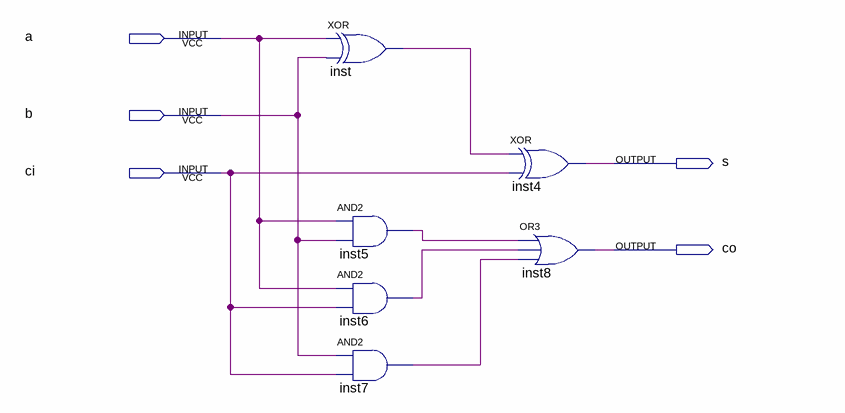
[diagram p0: schematic sheet]
// Quartus schematic plus_minus_1.bdf as structural Verilog: 6 symbols, 5 pins
module plus_minus_1 (
  input  a,
  input  b,
  input  ci,
  output s,
  output co
);

  wire inst5_out, inst6_out, inst7_out, inst_out;

  xor inst (inst_out, a, b);
  and inst5 (inst5_out, a, b);
  and inst6 (inst6_out, a, ci);
  and inst7 (inst7_out, b, ci);
  xor inst4 (s, inst_out, ci);
  or inst8 (co, inst5_out, inst6_out, inst7_out);
endmodule
